# EAGLE schematic Amazing-All-Band-Receiver-New (EAGLE 7.2.0)
The Amazing All-Band Receiver http://www.techlib.com/electronics/allband.htm http://theradioboard.com/rb/viewtopic.php?t=4625 http://www.transkommunikation.ch/dateien/schaltungen/diverse_schaltungen/radio_circuits/Amazing%20All-Band%20Receiver.pdf
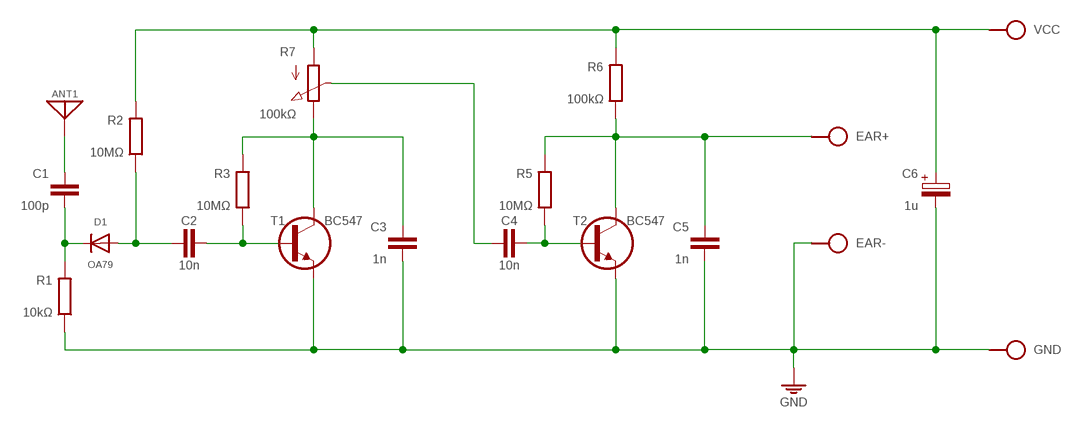
[diagram p0: schematic, sheet 1]

## Parts
ANT1  ANT  [SPAD]
C1  100p  C050-020X036/V  [C050-020X036/V]
C2  10n  C050-020X036  [C050-020X036]
C3  1n  C050-020X036  [C050-020X036]
C4  10n  C050-020X036  [C050-020X036]
C5  1n  C050-020X036  [C050-020X036]
C6  1u  CPOLE2,5-3  [E2,5-3]
D1  OA79  1N414834-7V  [DO34-7V]
EAR+  SPAD  [SPAD]
EAR-  SPAD  [SPAD]
GND  SPAD  [SPAD]
R1  10kΩ  R0202/7-V  [0202/7-V]
R2  10MΩ  R0202/7  [0202/7]
R3  10MΩ  R0202/7-V  [0202/7-V]
R5  10MΩ  R0202/7-V  [0202/7-V]
R6  100kΩ  R0202/7-V  [0202/7-V]
R7  100kΩ  POT  [POT]
T1  BC547  BC547CBE  [TO92-CBE]
T2  BC547  BC547CBE  [TO92-CBE]
VCC  SPAD  [SPAD]

## Nets
AC: C1.2 D1.C R1.2
ANT: ANT1.1 C1.1
DC: C2.2 D1.A R2.1
GND: C3.2 C5.2 C6.- EAR-.1 GND.1 R1.1 T1.E T2.E
I1: C2.1 R3.1 T1.B
I2: C4.1 R5.1 T2.B
O1: C3.1 R3.2 R7.3(E) T1.C
O2: C5.1 EAR+.1 R5.2 R6.1 T2.C
VCC: C6.+ R2.2 R6.2 R7.1(A) VCC.1
VO1: C4.2 R7.2(S)

## Library data of the parts
ANT1 = pad:ANT
C1-C5 = c:C: CAPACITOR, European symbol
C6 = c:CPOL: POLARIZED CAPACITOR, European symbol
D1 = d:1N4148
EAR+ EAR- GND VCC = pad:SPAD
R1-R3 R5 R6 = r:R: RESISTOR, European symbol
R7 = r:POT
T1 T2 = t:BC547

## Net classes
0 default: width 0.61 mm